# EAGLE design EuroDrum (EAGLE 8.2.1)
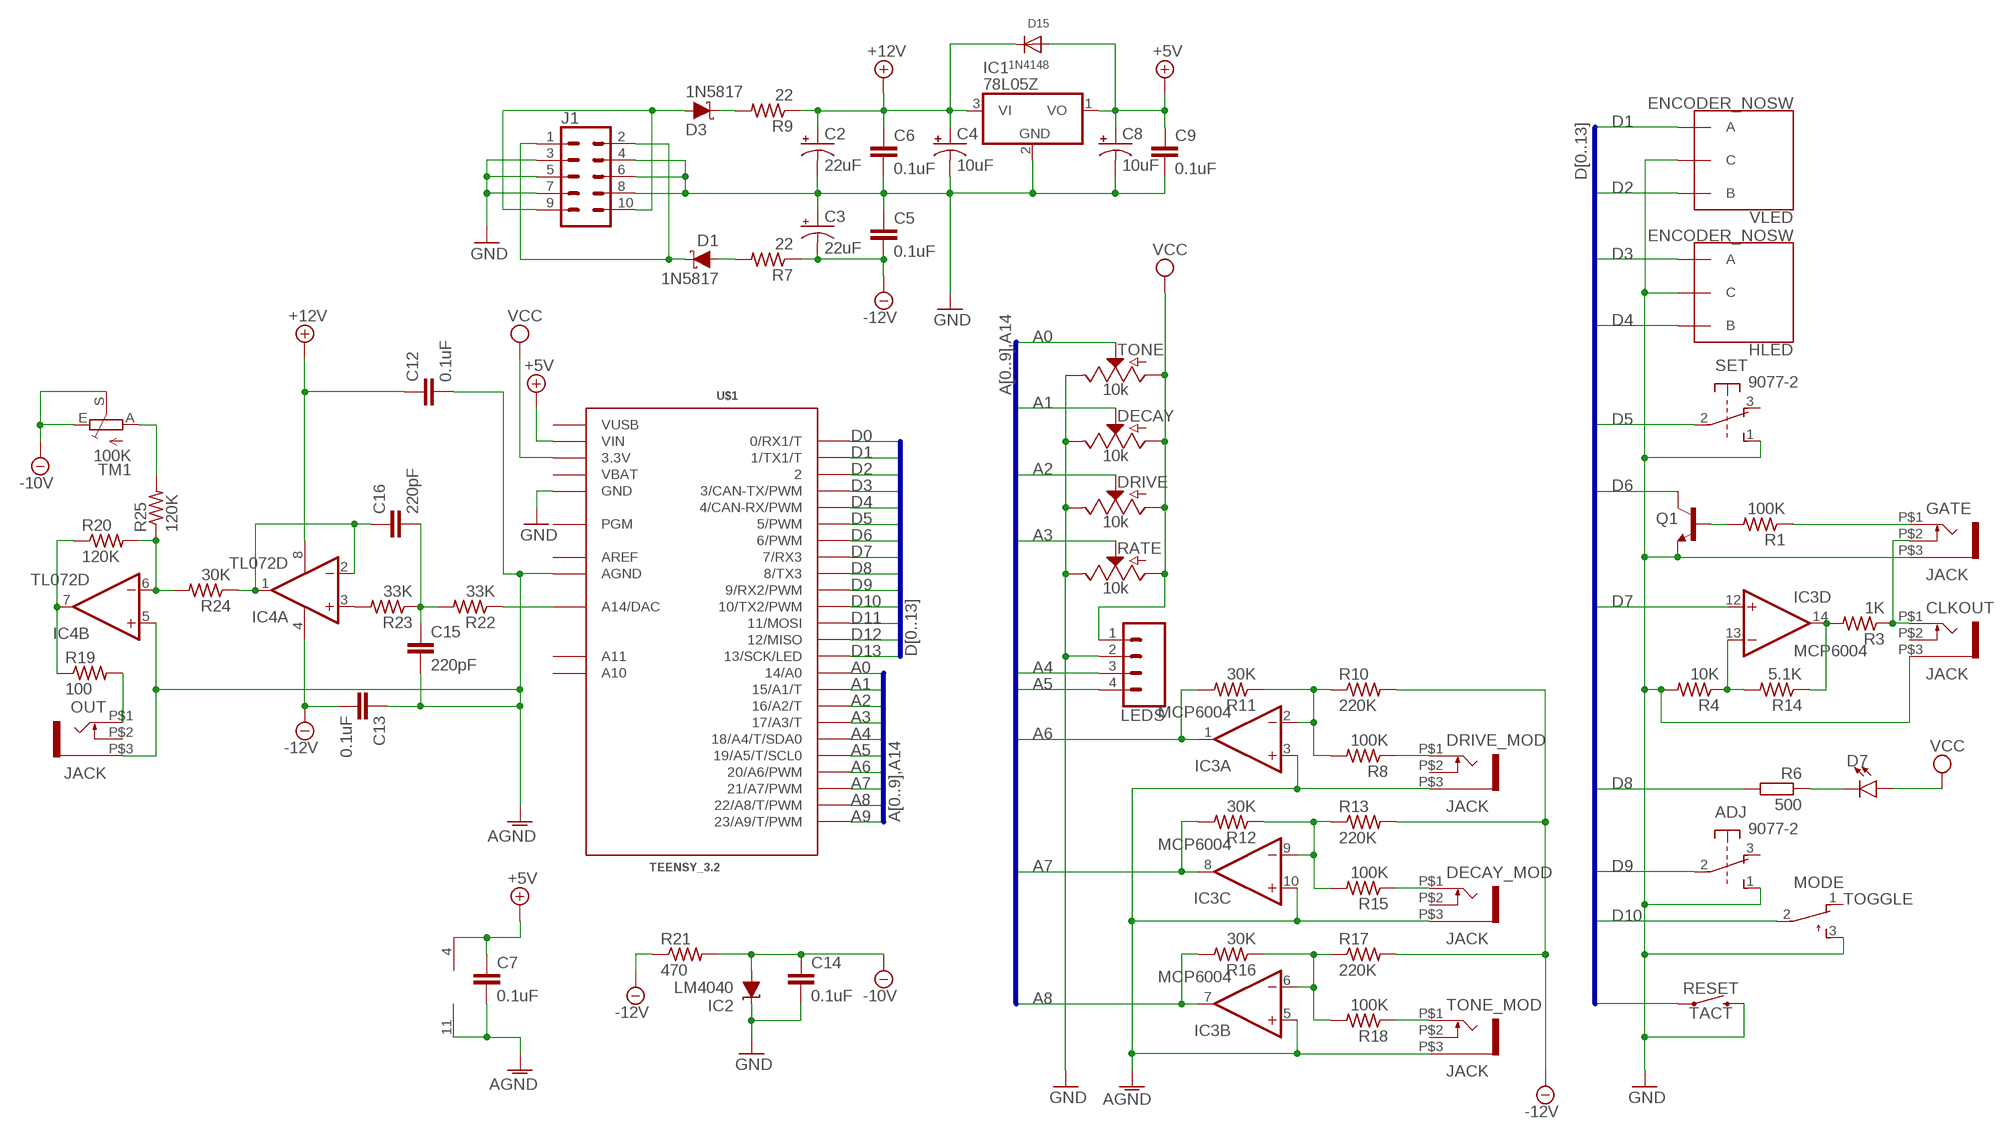
[diagram p0: schematic, sheet 1]

## Parts
ADJ  9077-2  [9077-2]
C2  22uF  10UF-POLAR-RADIAL-2.5MM-25V-20%  [CPOL-RADIAL-2.5MM-5MM]
C3  22uF  10UF-POLAR-RADIAL-2.5MM-25V-20%  [CPOL-RADIAL-2.5MM-5MM]
C4  10uF  10UF-POLAR-RADIAL-2.5MM-25V-20%  [CPOL-RADIAL-2.5MM-5MM]
C5  0.1uF  C-EUC0603K  [C0603K]
C6  0.1uF  C-EUC0603K  [C0603K]
C7  0.1uF  C-EUC0603K  [C0603K]
C8  10uF  10UF-POLAR-RADIAL-2.5MM-25V-20%  [CPOL-RADIAL-2.5MM-5MM]
C9  0.1uF  C-EUC0603K  [C0603K]
C12  0.1uF  C-EUC0603K  [C0603K]
C13  0.1uF  C-EUC0603K  [C0603K]
C14  0.1uF  C-EUC0603K  [C0603K]
C15  220pF  C-EUC0603K  [C0603K]
C16  220pF  C-EUC0603K  [C0603K]
CLKOUT  JACK  WQP-PJ301M-12_JACK  [WQP-PJ301M-12_JACK]
D1  1N5817  DIODE-SCHOTTKY-BAT60A  [SOD-323]
D3  1N5817  DIODE-SCHOTTKY-BAT60A  [SOD-323]
D7  LED3MM  [LED_3MM]
D15  1N4148  DIODESOD-123  [SOD-123]
DECAY  10k  POTENTIOMETER-PTH-9MM-1/20W-20%  [POT-PTH-ALPS]
DECAY_MOD  JACK  WQP-PJ301M-12_JACK  [WQP-PJ301M-12_JACK]
DRIVE  10k  POTENTIOMETER-PTH-9MM-1/20W-20%  [POT-PTH-ALPS]
DRIVE_MOD  JACK  WQP-PJ301M-12_JACK  [WQP-PJ301M-12_JACK]
GATE  JACK  WQP-PJ301M-12_JACK  [WQP-PJ301M-12_JACK]
HLED  ENCODER_NOSW  [ENCODER_NOSW]
IC1  78L05Z  [TO92]
IC2  LM4040  LM4041A12DBZ  [DBZ_R-PDSO-G3]
IC3  MCP6004  4AMP_P4+11D  [SO14]
IC4  TL072D  [SO08]
J1  CONN_05X2SHD  [2X5-SHROUDED]
LEDS  CONN_04LONGPADS  [1X04_LONGPADS]
MODE  TOGGLE  TL32YOSP_BKT  [TL3XYO]
OUT  JACK  WQP-PJ301M-12_JACK  [WQP-PJ301M-12_JACK]
Q1  BC549C  [TO92-EBC]
R1  100K  R-US_R0603  [R0603]
R3  1K  R-US_R0603  [R0603]
R4  10K  R-US_R0603  [R0603]
R6  500  R-EU_R0603  [R0603]
R7  22  R-US_R0603  [R0603]
R8  100K  R-US_R0603  [R0603]
R9  22  R-US_R0603  [R0603]
R10  220K  R-US_R0603  [R0603]
R11  30K  R-US_R0603  [R0603]
R12  30K  R-US_R0603  [R0603]
R13  220K  R-US_R0603  [R0603]
R14  5.1K  R-US_R0603  [R0603]
R15  100K  R-US_R0603  [R0603]
R16  30K  R-US_R0603  [R0603]
R17  220K  R-US_R0603  [R0603]
R18  100K  R-US_R0603  [R0603]
R19  100  R-US_R0603  [R0603]
R20  120K  R-US_R0603  [R0603]
R21  470  R-US_R0603  [R0603]
R22  33K  R-US_R0603  [R0603]
R23  33K  R-US_R0603  [R0603]
R24  30K  R-US_R0603  [R0603]
R25  120K  R-US_R0603  [R0603]
RATE  10k  POTENTIOMETER-PTH-9MM-1/20W-20%  [POT-PTH-ALPS]
RESET  TACT  MOMENTARY-SWITCH-SPST-PTH-6.0MM  [TACTILE_SWITCH_PTH_6.0MM]
SET  9077-2  [9077-2]
TM1  100K  TRIM_EU-CA6H  [CA6H]
TONE  10k  POTENTIOMETER-PTH-9MM-1/20W-20%  [POT-PTH-ALPS]
TONE_MOD  JACK  WQP-PJ301M-12_JACK  [WQP-PJ301M-12_JACK]
U$1  TEENSY_3.2  TEENSY_3.1-3.2_ALL_PINS  [TEENSY_3.0-3.2&LC_ALL_PINS]
VLED  ENCODER_NOSW  [ENCODER_NOSW]

## Nets
+5V: C7.1 C8.1(+) C9.1 D15.A IC1.1(VO) IC3.4(P:V+) U$1.VIN
+12V: C2.1(+) C4.1(+) C6.1 C12.1 D15.C IC1.3(VI) IC4.8(P:V+) R9.1
-10V: C14.1 IC2.2(A) R21.2 TM1.E TM1.S
-12V: C3.2(-) C5.2 C13.2 IC4.4(P:V-) R7.1 R10.2 R13.2 R17.2 R21.1
A0: TONE.P$2(S) U$1.14/A0
A1: DECAY.P$2(S) U$1.15/A1(15/A1/T)
A2: DRIVE.P$2(S) U$1.16/A2(16/A2/T)
A3: RATE.P$2(S) U$1.17/A3(17/A3/T)
A4: LEDS.3 U$1.18/A4(18/A4/T/SDA0)
A5: LEDS.4 U$1.19/A5(19/A5/T/SCL0)
A6: IC3.1(A:OUT) R11.2 U$1.20/A6(20/A6/PWM)
A7: IC3.8(C:OUT) R12.2 U$1.21/A7(21/A7/PWM)
A8: IC3.7(B:OUT) R16.2 U$1.22/A8(22/A8/T/PWM)
A9: U$1.23/A9(23/A9/T/PWM)
AGND: C7.2 C12.2 C13.1 C15.2 DECAY_MOD.P$3 DRIVE_MOD.P$3 IC3.3(A:+IN) IC3.5(B:+IN) IC3.10(C:+IN) IC3.11(P:V-) IC4.5(B:+IN) OUT.P$3 TONE_MOD.P$3 U$1.AGND
D0: U$1.0(0/RX1/T)
D1: U$1.1(1/TX1/T) VLED.A
D2: U$1.2 VLED.B
D3: HLED.A U$1.3(3/CAN-TX/PWM)
D4: HLED.B U$1.4(4/CAN-RX/PWM)
D5: SET.2(1:P) U$1.5(5/PWM)
D6: Q1.C U$1.6(6/PWM)
D7: IC3.12(D:+IN) U$1.7(7/RX3)
D8: R6.2 U$1.8(8/TX3)
D9: ADJ.2(1:P) U$1.9(9/RX2/PWM)
D10: MODE.2(P) U$1.10(10/TX2/PWM)
D11: RESET.1 U$1.11(11/MOSI)
D12: U$1.12(12/MISO)
D13: U$1.13(13/SCK/LED)
GND: ADJ.1(1:S) C2.2(-) C3.1(+) C4.2(-) C5.1 C6.2 C8.2(-) C9.2 C14.2 CLKOUT.P$3 DECAY.P$1(E) DRIVE.P$1(E) GATE.P$3 HLED.C IC1.2(GND) IC2.1(C) J1.3 J1.4 J1.5 J1.6 J1.7 J1.8 LEDS.2 MODE.3(S) Q1.E R4.2 RATE.P$1(E) RESET.3 SET.1(1:S) TONE.P$1(E) U$1.GND U$1.GND1(GND) VLED.C
N$4: D1.C J1.1 J1.2
N$5: IC3.9(C:-IN) R12.1 R13.1 R15.2
N$6: D3.A J1.9 J1.10
N$7: D3.C R9.2
N$8: DRIVE_MOD.P$1 R8.1
N$9: D1.A R7.2
N$10: IC3.2(A:-IN) R8.2 R10.1 R11.1
N$11: CLKOUT.P$1 GATE.P$2 R3.1
N$12: DECAY_MOD.P$1 R15.1
N$13: IC3.6(B:-IN) R16.1 R17.1 R18.2
N$14: R18.1 TONE_MOD.P$1
N$15: IC4.3(A:+IN) R23.2
N$16: Q1.B R1.2
N$17: C15.1 C16.2 R22.2 R23.1
N$18: R22.1 U$1.RESET/DAC(A14/DAC)
N$19: C16.1 IC4.1(A:OUT) IC4.2(A:-IN) R24.1
N$20: GATE.P$1 R1.1
N$21: IC3.13(D:-IN) R4.1 R14.2
N$22: D7.K(C) R6.1
N$23: IC4.6(B:-IN) R20.2 R24.2 R25.1
N$24: OUT.P$1 R19.2
N$25: IC4.7(B:OUT) R19.1 R20.1
N$26: R25.2 TM1.A
NOTE1: IC3.14(D:OUT) R3.2 R14.1
VCC: D7.A DECAY.P$3(A) DRIVE.P$3(A) LEDS.1 RATE.P$3(A) TONE.P$3(A) U$1.3.3V U$1.3.3V1(3.3V)
Unconnected: ADJ.3(1:O) ADJ.4(2:S) ADJ.5(2:P) ADJ.6(2:O) CLKOUT.P$2 DECAY_MOD.P$2 DRIVE_MOD.P$2 MODE.1(O) OUT.P$2 SET.3(1:O) SET.4(2:S) SET.5(2:P) SET.6(2:O) TONE_MOD.P$2 U$1.A10 U$1.A11 U$1.PGM

## Buses
A[0..9],A14
D[0..13]

## Power pins joined to a net without a drawn wire
AREF: U$1.AREF
VBAT: U$1.VBAT
VUSB: U$1.VUSB

## Library data of the parts
ADJ SET = switch-misc:9077-2: MARQUARDT SWITCH 9077.0200 Distributor: Buerklin <https://www.buerklin.com/default.asp?event=ShowArtikel%2812G2822%29&l=d&jump=ArtNr_12G2822>
C2 C3 = SparkFun-Capacitors:10UF-POLAR: 10.0µF polarized capacitors A capacitor is a passive two-terminal electrical component used to store electrical energy temporarily in an electric field.; PROD_ID: CAP-08440; VALUE: 10uF
C4 C8 = SparkFun-Capacitors:10UF-POLAR: 10.0µF polarized capacitors A capacitor is a passive two-terminal electrical component used to store electrical energy temporarily in an electric field.; PROD_ID: CAP-08440
C5-C7 C9 C12-C16 = rcl:C-EU: CAPACITOR, European symbol
CLKOUT DECAY_MOD DRIVE_MOD GATE OUT TONE_MOD = thonkiconn:WQP-PJ301M-12_JACK
D1 D3 = SparkFun-DiscreteSemi:DIODE-SCHOTTKY: Schottky diode A Schottky diode is a semiconductor diode which has a low forward voltage drop and a very fast switching action.; PROD_ID: DIO-14072; VALUE: 3A/10V/280mV
D7 = SparkFun-LED:LED: LED (Generic) Standard schematic elements and footprints for 5mm, 3mm, 1206, and 0603 sized LEDs. Generic LEDs with no color specified.; PROD_ID: DIO-08794
D15 = adafruit:DIODE: Diode SMADIODE - SMA Surface Mount Package 20V 1A Schottky Diode Digikey: 641-1014-6-ND DO-1N4148 - Through Hole Small Current Diode SOD-123 20V 1 A (.5mV Vf) Schottky Diode - Digikey: MBRX120TPMSCT-ND SOD-323 10V 570mA (.38mV Vf, 3ns) Schottky Diode - Digikey: ZLLS410CT-ND SOD-523 30V 30mA Schottky Diode (RB751S-40TE61) - Digikey: RB751S-40TE61CT-ND SOT23-R/W - SOT23 Package (R = Solder Paste/Reflow Ovens, W = Hand-Soldering) BAT54Film 40V 300mA - Digikey: 497-7162-1-ND
DECAY DRIVE RATE TONE = SparkFun-Resistors:POTENTIOMETER: Potentiometer (Pot) Three-terminal potentiometers, with an adjustable wiper and two adjustable resistors. A pot can be used to create a configurable voltage divider, or as a variable resistor. Variants ALPS_POT and ALPS_POT_KIT - PTH, breadboard compatible, 9mm square pots Rotary Potentiometer - Linear (10k ohm) <https://www.sparkfun.com/products/9288> (COM-09288) The KIT variant exposes copper on only one side of the PTH pad, so the part can only be assembled on one side of the PCB. Useful for beginner soldering kits.; PROD_ID: RES-09177; SF_SKU: COM-09288
HLED VLED = SparkFun-Switches:ENCODER_NOSW
IC1 = linear:78*: Positive VOLTAGE REGULATOR Source: http://cache.national.com/ds/LM/LM78L05.pdf http://www.fairchildsemi.com/ds/LM/LM7805.pdf
IC2 = texas:LM4041: PRECISION MICROPOWER SHUNT VOLTAGE REFERENCE Source: http://focus.ti.com/lit/ds/slcs146e/slcs146e.pdf; MPN: LM4041A12IDBZR; OC_FARNELL: 1407949; OC_NEWARK: 58K5875
IC3 = linear:4AMP_P4+11: OP AMP
IC4 = linear:TL072: OP AMP
J1 = SparkFun-Connectors:CONN_05X2: Multi connection point. Often used as Generic Header-pin footprint for 0.1 inch spaced/style header connections For AVR SPI programming port, see special device with nice symbol: "AVR_SPI_PROG_5x2.dev" You can populate with any combo of single row headers, but if you'd like an exact match, check these: 2x5 AVR ICSP Male Header <https://www.sparkfun.com/products/778> (PRT-00778) 2x5 Pin Shrouded Header <https://www.sparkfun.com/products/8506> (PRT-08506) On any of the 0.1 inch spaced packages, you can populate with these: Break Away Headers - Straight <https://www.sparkfun.com/products/116> (PRT-00116) Break Away Male Headers - Right Angle <https://www.sparkfun.com/products/553> (PRT-00553) Female Headers <https://www.sparkfun.com/products/115> (PRT-00115) Break Away Headers - Machine Pin <https://www.sparkfun.com/products/117> (PRT-00117) Break Away Female Headers - Swiss Machine Pin <https://www.sparkfun.com/products/743> (PRT-00743) Special note: the shrouded connector mates well with our 5x2 ribbon cables: 2x5 Pin IDC Ribbon Cable <https://www.sparkfun.com/products/8535> (PRT-08535); PROD_ID: CONN-08671; SF_ID: PRT-08506
LEDS = SparkFun-Connectors:CONN_04: Multi connection point. Often used as Generic Header-pin footprint for 0.1 inch spaced/style header connections On any of the 0.1 inch spaced packages, you can populate with these: Break Away Headers - Straight <https://www.sparkfun.com/products/116> (PRT-00116) Break Away Male Headers - Right Angle <https://www.sparkfun.com/products/553> (PRT-00553) Female Headers <https://www.sparkfun.com/products/115> (PRT-00115) Break Away Headers - Machine Pin <https://www.sparkfun.com/products/117> (PRT-00117) Break Away Female Headers - Swiss Machine Pin <https://www.sparkfun.com/products/743> (PRT-00743) For SCREWTERMINALS and SPRING TERMINALS visit here: Screw Terimnals on SparkFun.com <https://www.sparkfun.com/search/results?term=Screw+Terminals> (5mm/3.5mm/2.54mm spacing) This device is also useful as a general connection point to wire up your design to another part of your project. Our various solder wires solder well into these plated through hole pads. Hook-Up Wire - Assortment (Stranded, 22 AWG) <https://www.sparkfun.com/products/11375> (PRT-11375) Hook-Up Wire - Assortment (Solid Core, 22 AWG) <https://www.sparkfun.com/products/11367> (PRT-11367) View the entire wire category on our website here <https://www.sparkfun.com/categories/141> Special notes: Molex polarized connector foot print use with SKU : PRT-08231 with associated crimp pins and housings. 1MM SMD Version SKU: PRT-10208; PROD_ID: CONN-09696
MODE = customswitch:TL32YO: TINY SWITCH ON - MOM Source: http://www2.produktinfo.conrad.com/datenblaetter/700000-724999/705152-da-01-de-Subminiaturschalter_TL_36YO.pdf
Q1 = transistor-npn:BC549*: NPN Transistor
R1 R3 R4 R7-R25 = rcl:R-US_: RESISTOR, American symbol
R6 = resistor:R-EU_: RESISTOR, European symbol
RESET = SparkFun-Switches:MOMENTARY-SWITCH-SPST: Momentary Switch (Pushbutton) - SPST Normally-open (NO) SPST momentary switches (buttons, pushbuttons). Variants PTH-12MM - 12mm square, through-hole Momentary Pushbutton Switch - 12mm Square <https://www.sparkfun.com/products/9190> (COM-09190) PTH-6.0MM, PTH-6.0MM-KIT - 6.0mm square, through-hole Mini Pushbutton Switch <https://www.sparkfun.com/products/97> (COM-00097) KIT package intended for soldering kit's - only one side of pads' copper is exposed. PTH-RIGHT-ANGLE-KIT - Right-angle, through-hole Right Angle Tactile Button <https://www.sparkfun.com/products/10791> - Used on SparkFun BigTime Watch Kit <https://www.sparkfun.com/products/11734> SMD-12MM - 12mm square, surface-mount Tactile Button - SMD (12mm) <https://www.sparkfun.com/products/12993> (COM-12993) Used on SparkFun PicoBoard <https://www.sparkfun.com/products/11888> SMD-4.5MM - 4.5mm Square Trackball Switch Used on SparkFun Blackberry Trackballer Breakout <https://www.sparkfun.com/products/13169> SMD-4.6MMX2.8MM - 4.60mm x 2.80mm, surface mount Used on SparkFun Pro Micro - RP2040 <https://www.sparkfun.com/products/17717> SMD-5.2MM, SMD-5.2-REDUNDANT - 5.2mm square, surface-mount Mini Pushbutton Switch - SMD <https://www.sparkfun.com/products/8720> (COM-08720) Used on Arduino Pro Mini <https://www.sparkfun.com/products/11114> REDUNDANT package connects both switch circuits together SMD-6.0X3.5MM - 6.0 x 3.5mm, surface mount Momentary Reset Switch SMD <https://www.sparkfun.com/products/8229> (COM-08229) SMD-6.2MM-TALL - 6.2mm square, surface mount Tactile Button - SMD (6mm) <https://www.sparkfun.com/products/12992> Used on SparkFun Digital Sandbox <https://www.sparkfun.com/products/12651> SMD-RIGHT-ANGLE - Right-angle, surface mount Used on SparkFun Block for Intel® Edison - Arduino <https://www.sparkfun.com/products/13036>; PROD_ID: SWCH-08441; SF_SKU: COM-00097
TM1 = pot:TRIM_EU-: POTENTIOMETER
U$1 = Teensy_3_and_LC_Series_Boards_v1.4:TEENSY_3.1-3.2_ALL_PINS: Footprint for Teensy 3.1 or 3.2 board using all through-holes, i.e. the entire perimeter plus the 4 through-holes inboard (A10,A11,AREF, VUSB)

## Board
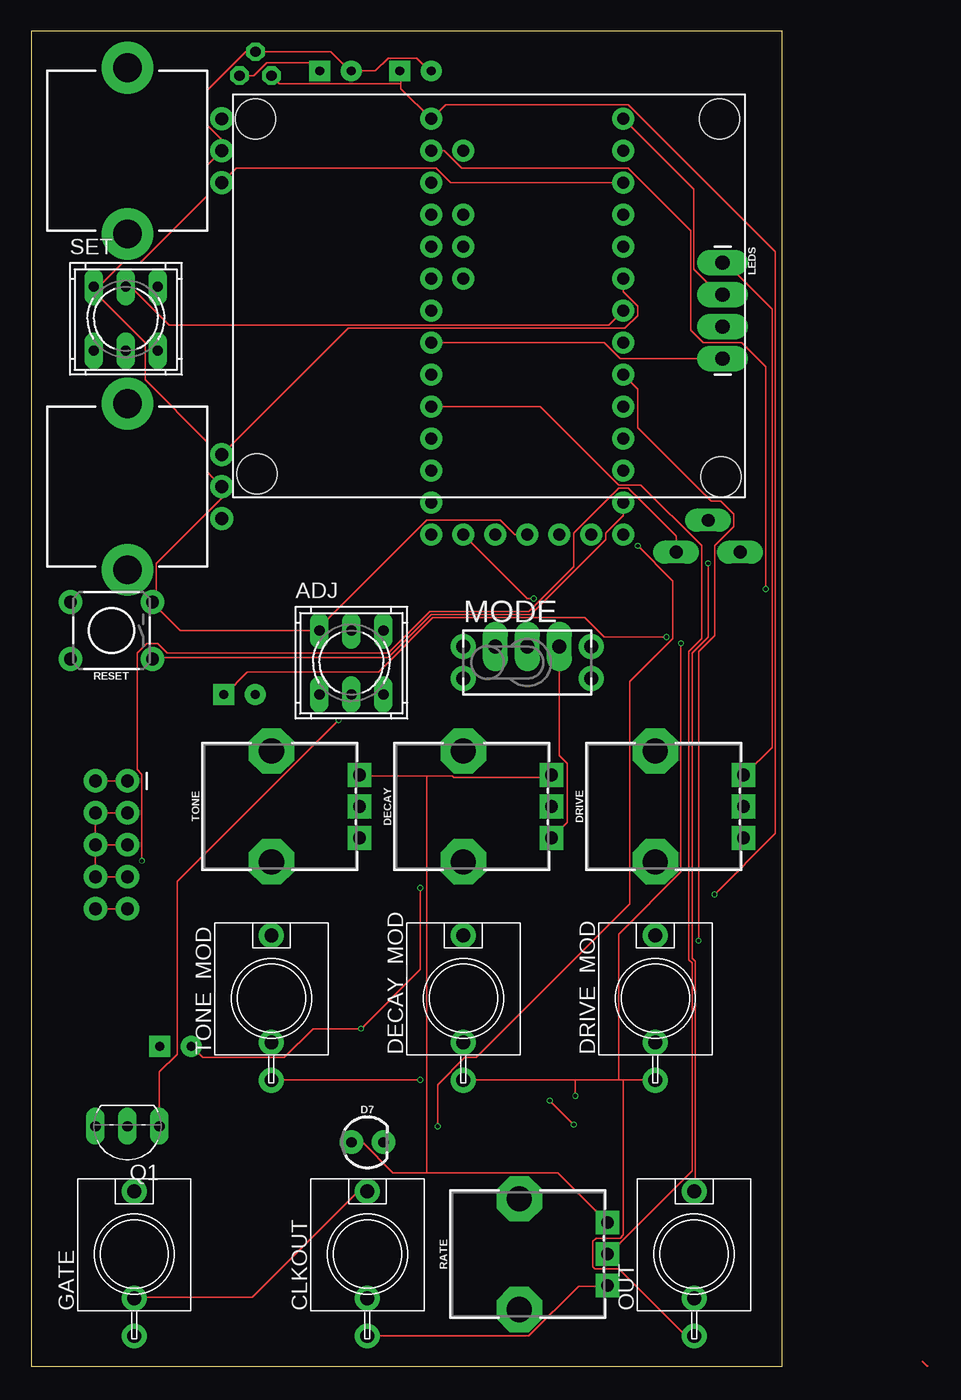
[diagram p1: board, top side]
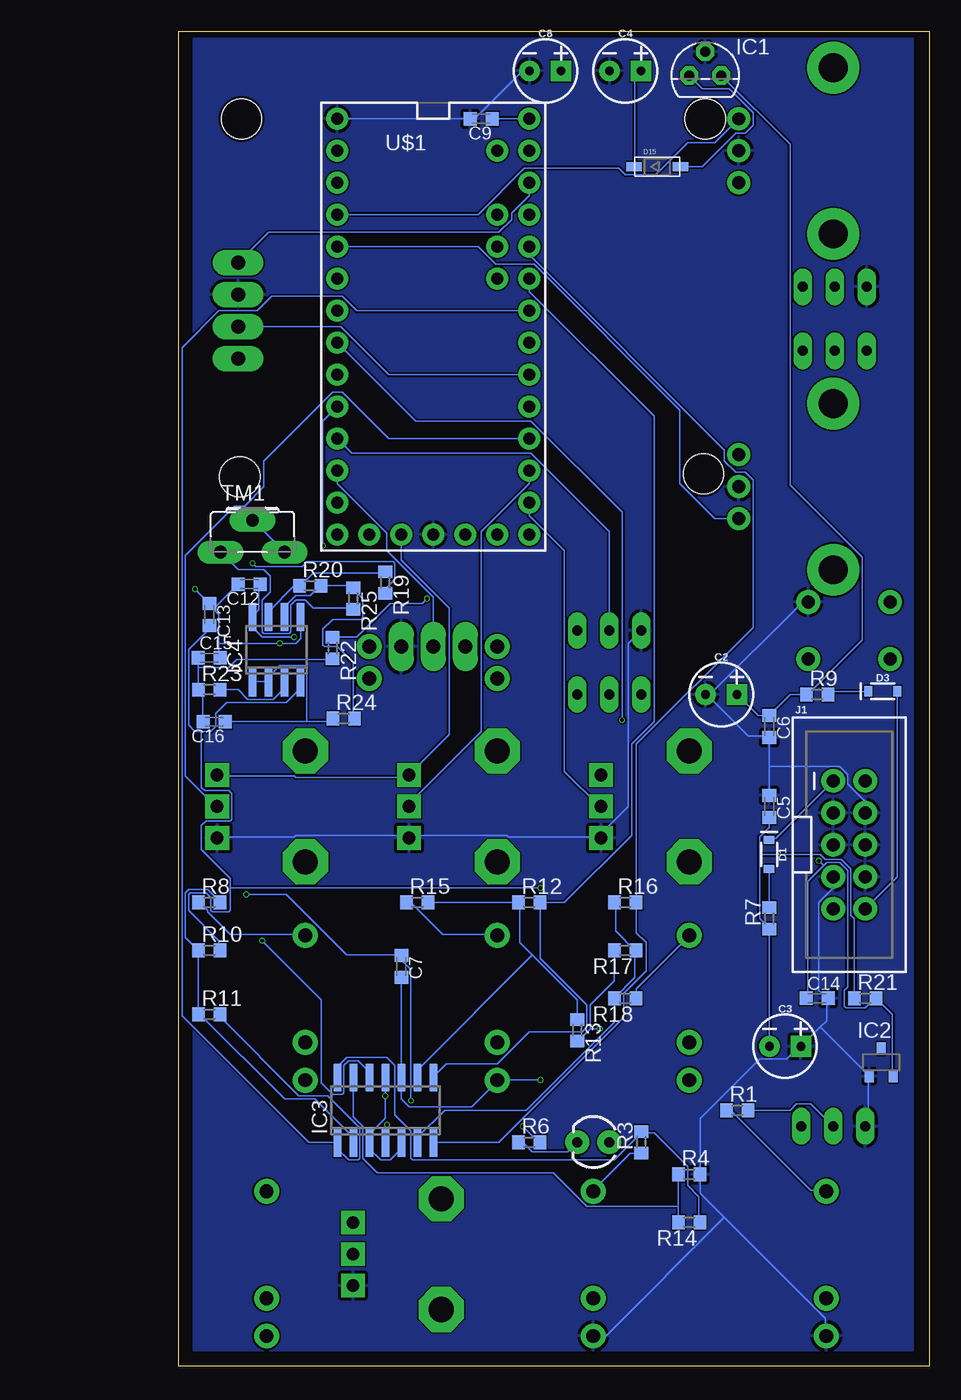
[diagram p2: board, bottom side, seen from below]

Size 59.6 x 106 mm. Coordinates in mm from the lower left corner, seen from the top.
Outline: 0,0 59.6,0 59.6,106 0,106 0,0
Copper layers (1*16): Top 0.035mm / dielectric 1.6mm / Bottom 0.035mm
Design rules "jlcpcb-2layers": minimum track width 5mil, minimum drill 0.3mm, track to track 5mil, track to pad 5mil, pad to pad 5mil, via to via 5mil, smd to smd 5mil, copper to edge 0.2mm, drill to drill 6mil, minimum pad ring 10mil, minimum via ring 3mil, stop-mask expansion 4mil, vias tented up to drill 0mil, thermal gap 10mil
Holes 3.2 mm at 17.78,99.06 54.61,99.06 17.91,70.87 54.74,70.61

### Footprints (pad centres in the part's own frame; a part is rotated, then mirrored left to right if it is on the bottom)
9077-2 = drill 0.813 long: 1 -2.54,2.54; 2 0,2.54; 3 2.54,2.54; 4 -2.54,-2.54; 5 0,-2.54; 6 2.54,-2.54
CPOL-RADIAL-2.5MM-5MM = drill 0.7 pad 1.651 square: 1 1.25,0 | drill 0.7 pad 1.651: 2 -1.25,0
C0603K = smd 1.05 x 1.08: 1 -0.875,0; 2 0.875,0
WQP-PJ301M-12_JACK = drill 1.1: P$1 0,5; P$2 0,-3.5; P$3 0,-6.5
SOD-323 = smd 0.63 x 0.83: A 1.15,0; C -1.15,0
LED_3MM = drill 0.813 pad 1.88: A -1.27,0; K 1.27,0
SOD-123 = smd 1.2 x 0.7: A 1.85,0; C -1.85,0
POT-PTH-ALPS = drill 1 pad 1.88 square: P$1 7,-2.5; P$2 7,0; P$3 7,2.5 | drill 2 octagon: P$4 0,-4.4; P$5 0,4.4
ENCODER_NOSW = drill 1.016: A 7.493,-2.54; B 7.493,2.54; C 7.493,0 | drill 2.286: P$3 0,6.604; P$4 0,-6.604
TO92 = drill 0.813 octagon: 1 -1.27,0; 2 0,1.905; 3 1.27,0
DBZ_R-PDSO-G3 = smd 0.7 x 1: 1 -0.95,-1.1; 2 0.95,-1.1; 3 0,1.1
SO14 = smd 0.6 x 2.2: 1 -3.81,-2.6; 2 -2.54,-2.6; 3 -1.27,-2.6; 4 0,-2.6; 5 1.27,-2.6; 6 2.54,-2.6; 7 3.81,-2.6; 8 3.81,2.6; 9 2.54,2.6; 10 1.27,2.6; 11 0,2.6; 12 -1.27,2.6; 13 -2.54,2.6; 14 -3.81,2.6
SO08 = smd 0.6 x 2.2: 1 -1.905,-2.6; 2 -0.635,-2.6; 3 0.635,-2.6; 4 1.905,-2.6; 5 1.905,2.6; 6 0.635,2.6; 7 -0.635,2.6; 8 -1.905,2.6
2X5-SHROUDED = drill 1.016 pad 1.88: 1 -1.27,5.08; 2 1.27,5.08; 3 -1.27,2.54; 4 1.27,2.54; 5 -1.27,0; 6 1.27,0; 7 -1.27,-2.54; 8 1.27,-2.54; 9 -1.27,-5.08; 10 1.27,-5.08
1X04_LONGPADS = drill 1.118 pad 1.88 long: 1 0,0; 2 2.54,0; 3 5.08,0; 4 7.62,0
TL3XYO = drill 1.1 pad 1.422 long: 1 -2.54,1.27; 2 0,1.27; 3 2.54,1.27 | drill 1.1 pad 1.676: M1 -5.08,1.27; M2 5.08,1.27; M3 -5.08,-1.27; M4 5.08,-1.27
TO92-EBC = drill 0.813 long: B 0,-1.27; C -2.54,-1.27; E 2.54,-1.27
R0603 = smd 1 x 1.1: 1 -0.85,0; 2 0.85,0
TACTILE_SWITCH_PTH_6.0MM = drill 1.016 pad 1.88: 1 -3.251,2.261; 2 3.251,2.261; 3 -3.251,-2.261; 4 3.251,-2.261
CA6H = drill 1.016 long: A -2.54,0; E 2.54,0; S 0,2.54
TEENSY_3.0-3.2&LC_ALL_PINS = drill 0.965: 0 -7.62,13.97; 1 -7.62,11.43; 2 -7.62,8.89; 3 -7.62,6.35; 3.3V 7.62,11.43; 3.3V1 -2.54,-16.51; 4 -7.62,3.81; 5 -7.62,1.27; 6 -7.62,-1.27; 7 -7.62,-3.81; 8 -7.62,-6.35; 9 -7.62,-8.89; 10 -7.62,-11.43; 11 -7.62,-13.97; 12 -7.62,-16.51; 13 7.62,-16.51; 14/A0 7.62,-13.97; 15/A1 7.62,-11.43; 16/A2 7.62,-8.89; 17/A3 7.62,-6.35; 18/A4 7.62,-3.81; 19/A5 7.62,-1.27; 20/A6 7.62,1.27; 21/A7 7.62,3.81; 22/A8 7.62,6.35; 23/A9 7.62,8.89; A10 5.08,6.35; A11 5.08,3.81; AGND 7.62,13.97; AREF 5.08,8.89; GND -7.62,16.51; GND1 0,-16.51; PGM 2.54,-16.51; RESET/DAC 5.08,-16.51; VBAT -5.08,-16.51; VIN 7.62,16.51; VUSB 5.08,13.97

### Placement (x,y rotation side)
ADJ  25.4,55.88 0 top
C2  16.51,53.34 0 bottom
C3  11.43,25.4 0 bottom
C4  24.13,102.87 0 bottom
C5  12.7,44.45 270 bottom
C6  12.7,50.8 270 bottom
C7  41.91,31.75 270 bottom
C8  30.48,102.87 0 bottom
C9  35.56,99.06 180 bottom
C12  53.98,62.1 180 bottom
C13  57.15,59.69 270 bottom
C14  8.89,29.21 0 bottom
C15  57.15,56.26 0 bottom
C16  56.77,51.18 180 bottom
CLKOUT  26.67,8.89 0 top
D1  12.7,40.64 270 bottom
D3  3.68,53.59 0 bottom
D7  26.67,17.78 0 top
D15  21.59,95.25 0 bottom
DECAY  34.29,44.45 0 top
DECAY_MOD  34.29,29.21 0 top
DRIVE  49.53,44.45 0 top
DRIVE_MOD  49.53,29.21 0 top
GATE  8.16,8.89 0 top
HLED  7.62,69.85 0 top
IC1  17.78,102.49 0 bottom
IC2  3.81,24.13 0 bottom
IC3  43.18,20.32 0 bottom
IC4  51.82,56.9 0 bottom
J1  6.35,41.4 0 bottom
LEDS  54.86,87.63 270 top
MODE  39.37,55.88 0 top
OUT  52.61,8.89 0 top
Q1  7.62,17.78 180 top
R1  15.24,20.32 0 bottom
R3  22.86,17.78 90 bottom
R4  19.05,15.24 0 bottom
R6  31.75,17.78 0 bottom
R7  12.7,35.56 90 bottom
R8  57.15,36.83 0 bottom
R9  8.89,53.34 0 bottom
R10  57.15,33.02 0 bottom
R11  57.15,27.94 0 bottom
R12  31.75,36.83 0 bottom
R13  27.94,26.67 270 bottom
R14  19.05,11.43 180 bottom
R15  40.64,36.83 0 bottom
R16  24.13,36.83 0 bottom
R17  24.13,33.02 180 bottom
R18  24.13,29.21 180 bottom
R19  43.18,62.23 270 bottom
R20  49.15,61.98 0 bottom
R21  5.08,29.21 0 bottom
R22  47.37,57.02 270 bottom
R23  57.15,53.72 0 bottom
R24  46.48,51.44 0 bottom
R25  45.72,60.96 270 bottom
RATE  38.73,8.89 0 top
RESET  6.35,58.42 180 top
SET  7.49,83.19 0 top
TM1  53.72,64.64 0 bottom
TONE  19.05,44.45 0 top
TONE_MOD  19.05,29.21 0 top
U$1  39.37,82.55 0 bottom
VLED  7.62,96.52 0 top

### Tracks (layer width: path | path; a pad name or v marks a point on that pad's centre or on a via)
+5V  (via drill 0.3)
  Top 0.127: v43.05,19.18 v41.15,21.08 | 29.34,101.85 29.34,101.47 U$1.VIN 32.89,100.2 47.37,100.2 59.05,88.52 59.05,42.29 v54.23,37.47 | 29.34,101.85 29.34,102.87 C8.1 | 29.34,101.85 19.68,101.85 IC1.1
  Bottom 0.127: v41.15,21.08 41.15,31.5 41.91,32.26 C7.1 41.91,32.64 46.23,32.64 51.05,37.47 v54.23,37.47 | v43.05,19.18 43.05,17.91 43.18,17.78 IC3.4 | U$1.VIN C9.1 | D15.A 18.03,95.25 15.37,97.92 14.61,97.92 13.97,98.55 13.97,99.57 15.88,101.47 18.03,101.47 IC1.1
+12V  (via drill 0.3)
  Top 0.127: IC1.3 17.65,102.49 18.67,103.5 22.23,103.5 22.86,102.87 C4.1 | v50.42,57.91 45.47,57.91 43.94,59.44 31.88,59.44 27.56,55.12 17.14,55.12 15.37,53.34 C2.1
  Bottom 0.127: D15.C 23.37,95.25 23.37,102.49 22.99,102.87 C4.1 | C12.1 53.21,62.1 53.21,60.07 53.72,59.56 IC4.8 53.72,58.67 52.96,57.91 v50.42,57.91 | 12.7,51.69 13.59,51.69 15.24,53.34 C2.1 | 12.7,51.69 11.05,53.34 R9.1 9.65,53.34 5.33,57.66 5.33,64.26 11.05,69.98 11.05,97.03 IC1.3 | 12.7,51.69 C6.1
-10V  (via drill 0.3)
  Top 0.127: TM1.E 51.18,65.91 47.37,69.72 46.61,69.72 43.05,66.17 43.05,63.5 39.5,59.94 31.62,59.94 28.32,56.64 10.79,56.64 10.03,57.4 9.14,57.4 8.38,56.64 8.38,47.37 8.76,46.99 v8.76,40.13
  Bottom 0.127: TM1.S TM1.E | IC2.2 2.92,23.11 2.92,27.94 4.19,29.21 R21.2 4.32,29.21 5.08,28.45 6.6,28.45 6.73,28.57 6.73,29.84 6.48,30.1 6.48,39.37 7.11,40.01 8.13,40.01 8.38,39.75 | 8.38,39.75 9.65,38.48 9.65,29.21 C14.1 | 8.38,39.75 v8.76,40.13
-12V  (via drill 0.3)
  Top 0.127: C3.2 12.7,25.4 13.59,24.51 20.07,24.51 22.35,26.8 v26.16,26.8 30.86,31.5 v30.86,37.97
  Bottom 0.127: C13.2 57.15,58.55 58.8,56.9 58.8,50.93 58.29,50.42 57.78,50.42 | 57.78,50.42 57.02,50.42 56.64,50.8 56.64,51.82 55.75,52.7 51.05,52.7 49.91,53.85 IC4.4 | 55.5,37.97 55.5,38.73 57.78,41.02 57.78,42.93 57.4,43.31 55.5,43.31 55.37,43.43 55.37,45.47 55.63,45.72 57.53,45.72 57.78,45.97 57.78,50.42 | 55.5,37.97 55.5,36.2 55.63,36.07 56.9,36.07 57.02,36.2 57.02,37.21 57.4,37.59 58.67,37.59 58.8,37.47 58.8,36.2 56.39,33.78 56.39,33.02 R10.2 | 26.92,26.8 26.92,28.7 25.02,30.61 25.02,33.02 R17.2 | 26.92,26.8 27.94,25.78 R13.2 | C5.2 12.7,42.8 13.46,42.04 13.46,40.64 | 13.46,40.64 13.46,35.56 12.7,34.8 R7.1 12.7,25.4 C3.2 | 13.46,40.64 8.64,40.64 8.26,40.26 6.99,40.26 6.22,39.5 6.22,35.81 5.97,35.56 5.97,29.21 R21.1 | v26.16,26.8 26.92,26.8 | v30.86,37.97 55.5,37.97
A0
  Bottom 0.127: U$1.14/A0 31.75,67.56 28.96,64.77 28.96,47.24 26.16,44.45 TONE.P$2
A1
  Bottom 0.127: U$1.15/A1 31.75,70.1 35.56,66.29 35.56,50.42 41.27,44.7 41.27,44.45 DECAY.P$2
A2
  Bottom 0.127: U$1.16/A2 42.93,73.66 46.61,77.34 47.37,77.34 52.83,71.88 52.83,69.85 54.36,68.33 55.12,68.33 59.05,64.39 59.05,46.86 56.64,44.45 DRIVE.P$2
A3
  Top 0.127: U$1.17/A3 40.39,76.2 46.61,69.98 48.39,69.98 53.21,65.15 53.21,57.78 52.2,56.77 52.2,32.26 52.45,32 52.45,15.49 45.85,8.89 RATE.P$2
A4
  Bottom 0.127: U$1.18/A4 42.93,78.74 46.74,82.55 LEDS.3
A5
  Top 0.127: U$1.19/A5 45.47,81.28 46.74,80.01 LEDS.4
A6
  Bottom 0.127: R11.2 56.26,27.94 56.26,27.69 50.04,21.46 47.75,21.46 45.21,18.92 45.21,16.51 45.34,16.38 46.1,16.38 46.99,17.27 IC3.1 46.99,17.78 49.28,17.78 59.31,27.81 59.31,80.9 56.39,83.82 53.34,83.82 52.2,84.96 46.61,84.96 45.47,83.82 U$1.20/A6
A7
  Bottom 0.127: 30.86,36.83 30.86,32.38 27.18,28.7 27.18,26.92 27.56,26.54 31.75,26.54 34.29,24 38.35,24 39.37,22.99 IC3.8 | U$1.21/A7 31.75,85.34 21.84,75.44 21.84,51.18 23.62,49.4 23.62,42.16 28.96,36.83 30.86,36.83 | 30.86,36.83 R12.2
A8
  Bottom 0.127: 23.24,36.83 23.24,34.42 22.48,33.66 22.48,31.37 24.26,29.59 24.26,27.69 34.16,17.78 39.37,17.78 IC3.7 | U$1.22/A8 31.75,88.27 16.26,72.77 16.26,71.88 15.37,70.99 14.61,70.99 13.97,70.36 13.97,58.67 23.24,49.4 23.24,36.83 | 23.24,36.83 R16.2
AGND  (via drill 0.3)
  Top 0.127: v30.86,22.73 19.05,22.73 TONE_MOD.P$3 | 43.18,22.73 34.29,22.73 DECAY_MOD.P$3 | 43.18,22.73 46.61,22.73 | 46.61,22.73 46.99,22.73 | 46.99,22.73 49.53,22.73 DRIVE_MOD.P$3 | 46.99,22.73 46.99,10.41 46.74,10.16 44.83,10.16 44.58,9.91 44.58,7.87 44.7,7.75 46.61,7.75 51.94,2.41 52.58,2.41 OUT.P$3 | 43.18,22.73 v43.18,21.46 | U$1.AGND 32.77,96.52 34.16,95.12 47.37,95.12 52.32,90.17 52.32,82.3 53.34,81.28 56.39,81.28 58.29,79.38 v58.29,61.72 | 46.61,22.73 46.61,34.29 51.56,39.24 v51.56,57.4
  Bottom 0.127: IC3.5 41.91,17.27 42.8,16.38 43.56,16.38 44.45,17.27 IC3.3 44.45,18.41 43.18,19.68 v43.18,21.46 IC3.11 | C7.2 IC3.10 41.91,21.21 41.27,20.57 36.32,20.57 34.29,22.61 DECAY_MOD.P$3 34.29,22.73 v30.86,22.73 | 56.39,57.4 56.39,59.69 56.9,60.2 | 56.39,57.4 56.39,56.26 C15.2 | 56.9,60.2 57.15,60.45 C13.1 | 56.9,60.2 56.77,60.2 54.86,62.1 C12.2 | 56.9,60.2 C13.1 | IC4.5 49.91,57.78 50.29,57.4 v51.56,57.4 56.39,57.4 | v58.29,61.72 57.15,60.58 C13.1
D1
  Top 0.127: U$1.1 33.27,93.98 32.13,95.12 16.26,95.12 VLED.A
D2
  Bottom 0.127: U$1.2 35.81,91.44 32.13,95.12 24.64,95.12 24.13,94.61 21.72,94.61 19.18,97.16 17.02,97.16 VLED.B
D3
  Bottom 0.127: U$1.3 35.81,88.9 34.42,87.5 31.37,87.5 19.81,75.95 19.81,70.1 17.02,67.31 HLED.A
D4
  Top 0.127: U$1.4 46.99,85.34 48.13,84.2 48.13,83.44 47.12,82.42 25.15,82.42 HLED.B
D5
  Top 0.127: SET.2 7.87,85.72 10.92,82.68 45.85,82.68 U$1.5
D6  (via drill 0.3)
  Top 0.127: Q1.C 10.16,23.37 11.56,24.77 11.56,38.48 v24.38,51.31
  Bottom 0.127: v24.38,51.31 24.38,67.82 31.62,75.06 40.77,75.06 U$1.6
D7  (via drill 0.3)
  Top 0.127: v52.96,33.78 52.96,56.77 54.23,58.04 54.23,65.15 55.75,66.67 55.75,67.69 54.74,68.71 53.98,68.71 48.13,74.55 48.13,77.6 U$1.7
  Bottom 0.127: IC3.12 44.45,23.37 45.34,24.26 46.1,24.26 46.48,23.88 46.48,21.72 46.61,21.59 47.37,21.59 48.26,22.48 48.26,29.08 v52.96,33.78
D8  (via drill 0.3)
  Top 0.127: v32.26,19.05 32.26,22.35 34.42,24.51 35.31,24.51 47.5,36.7 47.5,54.36 50.93,57.78 50.93,62.36 v48.13,65.15
  Bottom 0.127: v32.26,19.05 30.99,17.78 R6.2 | v48.13,65.15 48.13,75.06 U$1.8
D9
  Bottom 0.127: ADJ.2 25.4,66.29 31.62,72.52 45.85,72.52 U$1.9
D10
  Bottom 0.127: U$1.10 46.99,70.1 43.05,66.17 43.05,64.77 39.37,61.09 MODE.2
D11
  Top 0.127: U$1.11 46.99,67.56 45.59,66.17 45.59,65.66 39.62,59.69 31.75,59.69 28.32,56.26 9.65,56.26 RESET.1
GND
  Top 0.127: 5.33,85.72 7.24,87.63 8.64,87.63 13.97,92.96 13.97,95.38 VLED.C 15.11,97.41 13.97,98.55 13.97,101.35 17.02,104.39 IC1.2 23.75,104.39 25.27,102.87 C4.2 27.3,102.87 28.32,103.89 30.61,103.89 31.62,102.87 C8.2 | LEDS.2 54.61,85.09 52.58,87.12 52.58,93.47 U$1.GND | MODE.3 41.91,48.51 42.55,47.88 42.55,43.18 41.4,42.04 DECAY.P$1 | 22.61,58.42 11.81,58.42 9.65,60.58 RESET.3 9.65,60.71 9.91,60.96 9.91,63.75 15.11,68.96 HLED.C 13.97,70.99 13.97,73.41 9.02,78.36 9.02,81.28 5.33,84.96 5.33,85.72 | U$1.GND1 38.35,66.04 37.21,67.18 31.37,67.18 22.61,58.42 | 22.61,58.42 ADJ.1 | J1.3 J1.4 J1.6 | J1.6 J1.8 J1.7 | J1.6 J1.5 | RATE.P$1 45.72,6.35 43.43,6.35 39.5,2.41 26.67,2.41 CLKOUT.P$3 | 5.33,85.72 SET.1
  Bottom 0.127: C8.2 32.26,102.87 36.07,99.06 C9.2 U$1.GND | DRIVE.P$1 56.52,42.04 50.42,42.04 50.29,42.16 41.53,42.16 41.4,42.04 DECAY.P$1 41.27,42.04 41.15,42.16 33.53,42.16 33.4,42.04 26.16,42.04 TONE.P$1 26.04,42.04 26.04,42.29 23.88,44.45 23.88,57.4 ADJ.1 | 12.7,47.62 C6.2 12.7,50.04 14.35,50.04 17.53,53.21 | 12.7,47.62 C5.1 | 17.53,53.21 17.65,53.34 C2.2 17.53,53.21 | J1.4 5.08,44.83 6.48,46.23 6.48,46.99 7.11,47.62 12.7,47.62 | Q1.E 4.83,19.3 4.83,22.99 IC2.1 4.83,23.11 8.64,26.92 | 8.13,29.21 8.13,27.43 8.64,26.92 | 8.64,26.92 10.16,25.4 C3.1 10.29,25.4 11.3,24.38 13.46,24.38 18.16,19.68 18.16,15.24 | 16.26,11.81 18.16,13.72 18.16,15.24 | 16.26,11.81 8.26,3.81 8.26,2.41 GATE.P$3 | 18.16,15.24 R4.2 | 16.26,11.81 25.65,2.41 26.67,2.41 CLKOUT.P$3 | J1.7 7.62,37.97 8.76,36.83 8.76,29.84 8.13,29.21 | 8.13,29.21 C14.2 | 17.53,53.21 10.16,60.58 9.65,60.58 RESET.3
  pour Bottom: 1.27,105.41 58.42,105.41 58.42,1.27 1.27,1.27
N$1
  Top 0.152: 70.74,0.38 71.12,0
N$4
  Top 0.127: J1.1 J1.2
  Bottom 0.127: J1.1 12.19,41.91 12.7,41.91 D1.C
N$5
  Bottom 0.127: R13.1 27.94,29.08 31.5,32.64 | 31.5,32.64 32.51,33.66 32.51,36.83 R12.1 R15.2 | IC3.9 40.64,23.5 31.5,32.64
N$6
  Top 0.127: J1.10 J1.9
  Bottom 0.127: J1.10 2.54,38.86 D3.A
N$7
  Bottom 0.127: D3.C 7.75,53.59 8,53.34 R9.2
N$8
  Bottom 0.127: R8.1 57.91,36.83 57.28,36.2 57.28,36.07 55.5,34.29 49.53,34.29 DRIVE_MOD.P$1
N$9
  Bottom 0.127: R7.2 D1.A
N$10
  Bottom 0.127: 58.04,33.02 58.04,27.94 R11.1 57.91,27.94 51.18,21.21 48.77,21.21 45.72,18.16 IC3.2 | 58.04,33.02 59.05,34.04 59.05,37.59 58.8,37.85 57.28,37.85 56.77,37.34 56.77,37.21 56.39,36.83 R8.2 | 58.04,33.02 R10.1
N$11
  Top 0.127: GATE.P$2 8.26,5.46 17.53,5.46 25.91,13.84 26.67,13.84 CLKOUT.P$1
  Bottom 0.127: R3.1 22.86,16.89 23.75,16.89 26.67,13.97 CLKOUT.P$1
N$12
  Bottom 0.127: R15.1 41.15,36.83 38.61,34.29 34.29,34.29 DECAY_MOD.P$1
N$13
  Bottom 0.127: 23.37,33.02 23.37,30.86 25.02,29.21 | 23.37,33.02 24.89,34.54 24.89,36.83 R16.1 | 23.37,33.02 R17.1 | IC3.6 40.64,18.16 38.48,20.32 32,20.32 25.02,27.3 25.02,29.21 | 25.02,29.21 R18.2
N$14
  Bottom 0.127: R18.1 23.24,29.21 23.24,29.97 19.05,34.16 TONE_MOD.P$1
N$15
  Bottom 0.127: R23.2 54.86,53.72 54.1,52.96 52.07,52.96 51.18,53.85 IC4.3
N$16
  Bottom 0.127: R1.2 11.05,20.32 10.54,20.83 9.4,20.83 Q1.B
N$17
  Bottom 0.127: C16.2 57.66,51.18 57.66,53.47 57.91,53.72 R23.1 58.04,53.72 58.04,55.5 | 58.04,55.5 58.04,56.26 C15.1 | 58.04,55.5 55.63,55.5 54.99,56.13 47.37,56.13 R22.2
N$18  (via drill 0.3)
  Top 0.127: v39.88,60.96 39.37,60.96 U$1.RESET/DAC
  Bottom 0.127: v39.88,60.96 40.26,60.58 42.8,60.58 45.47,57.91 47.37,57.91 R22.1
N$19
  Bottom 0.127: 52.45,54.36 53.72,54.36 IC4.1 | 49.4,51.18 47.62,51.18 47.37,51.44 R24.1 | 49.4,51.18 C16.1 | 52.45,54.36 52.45,54.74 51.56,55.63 49.53,55.63 49.4,55.5 49.4,51.18 | 52.45,54.36 IC4.2
N$20
  Bottom 0.127: R1.1 15.75,20.32 9.4,13.97 8.26,13.97 GATE.P$1
N$21
  Bottom 0.127: 19.94,12.7 19.94,15.24 R4.1 | 19.94,12.7 19.94,11.43 R14.2 | IC3.13 45.72,19.81 44.96,19.05 44.96,16.51 43.81,15.37 29.84,15.37 27.18,12.7 19.94,12.7
N$22
  Bottom 0.127: R6.1 32.26,17.78 31.5,17.02 28.7,17.02 D7.K
N$23
  Bottom 0.127: R24.2 45.72,51.44 45.72,55.88 46.99,57.15 48.01,57.15 48.13,57.28 48.13,58.55 47.37,59.31 45.09,59.31 44.96,59.44 44.96,60.96 45.72,61.72 R25.1 45.72,61.85 45.85,61.98 R20.2 48.39,61.98 49.15,61.21 50.29,61.21 51.18,60.33 IC4.6
N$24  (via drill 0.3)
  Top 0.127: v53.72,63.75 53.72,57.91 52.45,56.64 52.45,32.38 52.7,32.13 52.7,13.97 OUT.P$1
  Bottom 0.127: R19.2 43.18,61.72 42.42,62.48 42.42,63.75 42.55,63.88 49.4,63.88 49.78,63.5 53.47,63.5 v53.72,63.75
N$25
  Bottom 0.127: IC4.7 52.45,59.94 50.42,61.98 R20.1 49.91,61.98 48.9,62.99 43.18,62.99 R19.1
N$26
  Bottom 0.127: TM1.A 54.86,63.25 52.83,63.25 52.32,62.74 52.32,61.47 52.96,60.83 52.96,58.29 52.83,58.17 50.8,58.17 50.67,58.29 50.67,60.45 50.29,60.83 49.53,60.83 48.9,60.2 45.72,60.2 R25.2
NOTE1
  Bottom 0.127: 22.86,18.54 21.84,18.54 19.18,15.88 19.18,14.35 18.29,13.46 18.29,11.43 R14.1 | IC3.14 46.99,23.75 46.23,24.51 43.05,24.51 42.42,23.88 42.42,19.94 41.15,18.67 41.15,16.51 41.02,16.38 25.02,16.38 22.86,18.54 | 22.86,18.54 R3.2
VCC
  Top 0.127: D7.A 26.29,17.78 28.7,15.37 31.37,15.37 | 31.37,15.37 41.78,15.37 45.72,11.43 RATE.P$3 | 31.37,46.86 33.4,46.86 33.53,46.74 41.15,46.74 41.27,46.86 DECAY.P$3 | 31.37,46.86 26.16,46.86 TONE.P$3 | 31.37,46.86 31.37,15.37 | LEDS.1 55.12,87.63 58.8,83.95 58.8,49.15 56.64,46.99 DRIVE.P$3
  Bottom 0.127: U$1.3.3V 31.75,92.96 33.15,91.57 33.15,91.06 34.16,90.04 52.45,90.04 LEDS.1 | U$1.3.3V1 41.91,64.01 38.1,60.2 38.1,50.16 41.27,46.99 DECAY.P$3 41.4,46.86 41.53,46.74 50.29,46.74 50.42,46.86 56.52,46.86 DRIVE.P$3